# Altium schematic sheet Pwoer_module.SchDoc: Power_module
size A4; Date: 2018/10/8; Author: Wang Peirong; Revision: V1.1; SheetNumber: 3; Descripton: Supply 12V ，5V，3.3V; pages: 6; Size: A4
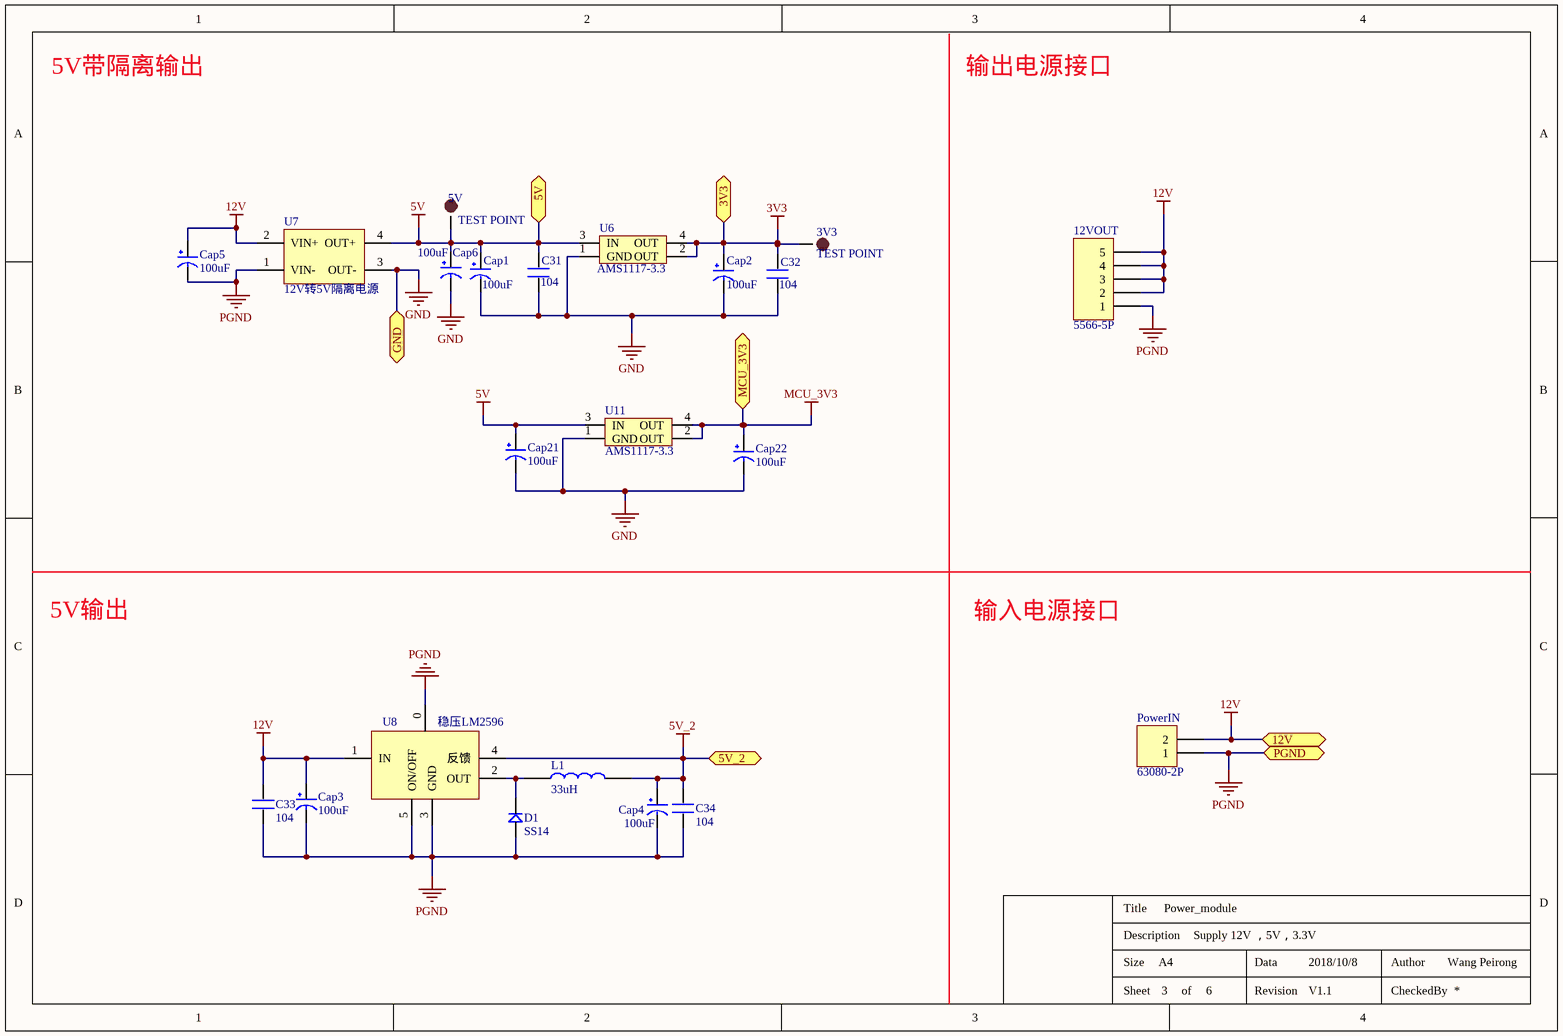
[diagram p0: Pwoer_module.SchDoc]

## Parts
3V3  TEST POINT  [TP-1.5]
5V  TEST POINT  [TP-1.5]
12VOUT  5566-5P  [5566-5P]
C31  104  [0603P]
C32  104  [0603P]
C33  104  [0603P]
C34  104  [0603P]
Cap1  100uF  [CC6.56.5]
Cap2  100uF  [CC6.56.5]
Cap3  100uF  [CC6.56.5]
Cap4  100uF  [CC6.56.5]
Cap5  100uF  [CC6.56.5]
Cap6  100uF  [CC6.56.5]
Cap21  100uF  [CC6.56.5]
Cap22  100uF  [CC6.56.5]
D1  SS14  [DIODE_SOP]
L1  value 33uH  [电感-10*10]  (hidden comment: 6电感)
PowerIN  63080-2P  [63038-2P]
U6  AMS1117-3.3  [AMS1117]
U7  12V转5V隔离电源  [WRB1205MH]
U8  稳压LM2596  [TO-263-5]
U11  AMS1117-3.3  [AMS1117]

## Ports
3V3, 5V, 5V_2, 12V, GND, MCU_3V3, PGND

## Nets
3V3: 3V3.1 C32.2 Cap2.1(VCC) U6.2(OUT) U6.4(OUT) ; port 3V3
5V: 5V.1 C31.2 Cap1.1(VCC) Cap6.1(VCC) Cap21.1(VCC) U6.3(IN) U7.4(OUT+) U11.3(IN) ; port 5V
5V_2: C34.2 Cap4.1(VCC) L1.2 U8.4(反馈) ; port 5V_2
12V: 12VOUT.2 12VOUT.3 12VOUT.4 12VOUT.5 C33.2 Cap3.1(VCC) Cap5.1(VCC) PowerIN.2 U7.2(VIN+) U8.1(IN) ; port 12V
GND: C31.1 C32.1 Cap1.2(GND) Cap2.2(GND) Cap6.2(GND) Cap21.2(GND) Cap22.2(GND) U6.1(GND) U7.3(OUT-) U11.1(GND) ; port GND
MCU_3V3: Cap22.1(VCC) U11.2(OUT) U11.4(OUT) ; port MCU_3V3
PGND: 12VOUT.1 C33.1 C34.1 Cap3.2(GND) Cap4.2(GND) Cap5.2(GND) D1.1 PowerIN.1 U7.1(VIN-) U8.0 U8.3(GND) U8.5(ON/OFF) ; port PGND
NetD1_2: D1.2 L1.1 U8.2(OUT)

## Notes on the sheet
- 5V带隔离输出
- 输出电源接口
- 5V输出
- 输入电源接口
- Title
- Description
- Size
- Data
- Author
- Sheet
- of
- Revision
- CheckedBy

## Library data of the parts
3V3 5V = TEST-POINT: 测试点
12VOUT = Header 5: Header, 5-Pin; LatestRevisionDate: 17-Jul-2002; LatestRevisionNote: Re-released for DXP Platform.; Publisher: Altium Limited
C31-C34 = C
Cap1-Cap6 Cap21 Cap22 = CAP
D1 = D
L1 = 6电感: Adjustable Inductor; Set Position: 0.5; Published: 24-Mar-1999; LatestRevisionDate: 17-Jul-2002; LatestRevisionNote: Re-released for DXP Platform.; PackageReference: AXIAL-0.8; Publisher: Altium Limited; PackageDescription: Axial Device, Thru-Hole; 2 Leads; 0.8 in Pin Spacing
PowerIN = Header 2: Header, 2-Pin; LatestRevisionDate: 17-Jul-2002; LatestRevisionNote: Re-released for DXP Platform.; Publisher: Altium Limited
U6 U11 = AMS1117